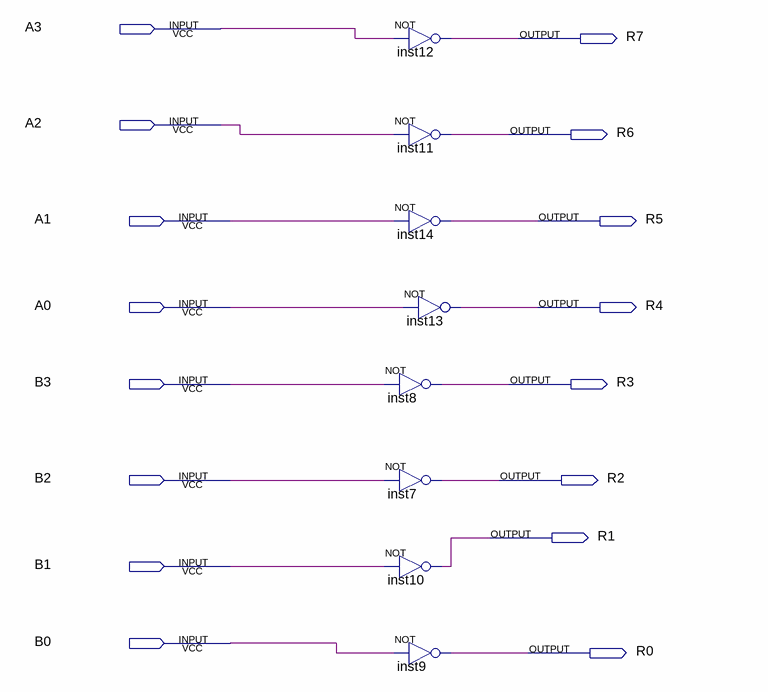
[diagram p0: schematic sheet]
// Quartus schematic ComNot.bdf as structural Verilog: 8 symbols, 16 pins
module ComNot (
  input  A3,
  input  A2,
  input  A1,
  input  A0,
  input  B3,
  input  B2,
  input  B1,
  input  B0,
  output R7,
  output R6,
  output R5,
  output R4,
  output R3,
  output R2,
  output R1,
  output R0
);

  not inst12 (R7, A3);
  not inst11 (R6, A2);
  not inst14 (R5, A1);
  not inst13 (R4, A0);
  not inst8 (R3, B3);
  not inst7 (R2, B2);
  not inst10 (R1, B1);
  not inst9 (R0, B0);
endmodule
